# EAGLE schematic TBEAM_V10_Stack (EAGLE 9.6.2)

## Sheet 1 of 2
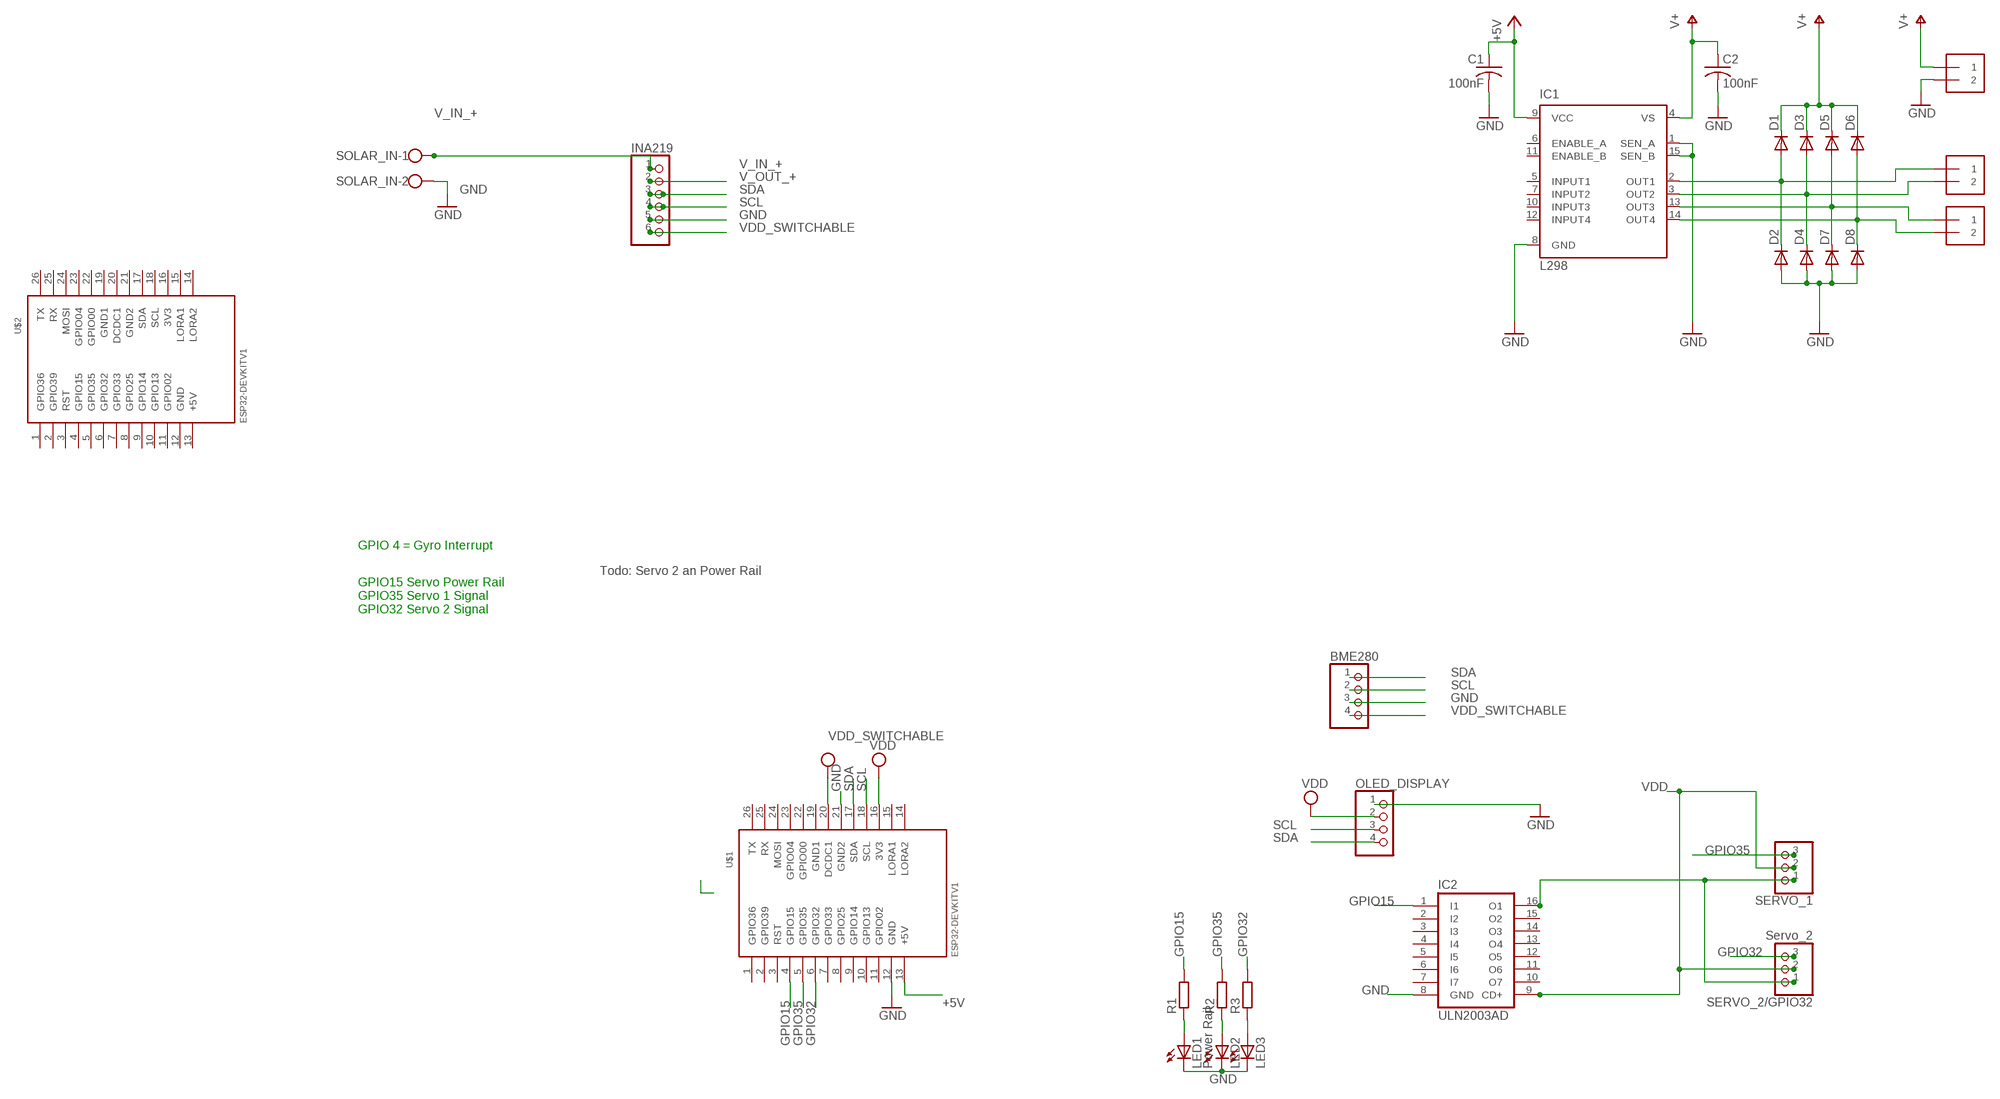
[diagram p0: schematic, sheet 1]

### Parts
BME280  PINHD-1X4  [1X04]
C1  100nF  C-US050-024X044  [C050-024X044]
C2  100nF  C-US050-024X044  [C050-024X044]
D1  DIODE-D-5  [D-5]
D2  DIODE-D-5  [D-5]
D3  DIODE-D-5  [D-5]
D4  DIODE-D-5  [D-5]
D5  DIODE-D-5  [D-5]
D6  DIODE-D-5  [D-5]
D7  DIODE-D-5  [D-5]
D8  DIODE-D-5  [D-5]
IC1  L298  [MULTIWATT-15]
IC2  ULN2003AD  [SO16]
INA219  PINHD-1X6  [1X06]
J1  1X2-3.5MM  [1X2-3.5MM]
J2  1X2-3.5MM  [1X2-3.5MM]
J3  1X2-3.5MM  [1X2-3.5MM]
LED1  Power Rail  LEDSML1206  [SML1206]
LED2  LEDSML1206  [SML1206]
LED3  LEDSML1206  [SML1206]
OLED_DISPLAY  PINHD-1X4  [1X04]
R1  R-EU_R1206  [R1206]
R2  R-EU_R1206  [R1206]
R3  R-EU_R1206  [R1206]
SERVO_1  PINHD-1X3  [1X03]
SERVO_2/GPIO32  Servo_2  PINHD-1X3  [1X03]
SOLAR_IN  W237-102  [W237-102]
U$1  ESP32DEVKITV1  [ESP32-DEVKITV1]
U$2  ESP32DEVKITV1  [ESP32-DEVKITV1]

### Nets
+5V: C1.1 IC1.9(VCC) U$1.13(+5V)
GND: BME280.3 C1.2 C2.2 D2.A D4.A D7.A D8.A IC1.1(SEN_A) IC1.8(GND) IC1.15(SEN_B) IC2.8(GND) INA219.5 J1.2 LED1.C LED2.C LED3.C OLED_DISPLAY.1 SOLAR_IN.2 U$1.12(GND) U$1.21(GND2)
GPIO15: IC2.1(I1) R1.2 U$1.4(GPIO15)
GPIO32: R3.2 SERVO_2/GPIO32.3 U$1.6(GPIO32)
GPIO35: R2.2 SERVO_1.3 U$1.5(GPIO35)
N$2: IC2.16(O1) SERVO_1.1 SERVO_2/GPIO32.1
N$4: LED1.A R1.1
N$5: LED2.A R2.1
N$6: LED3.A R3.1
N$7: D1.A D2.C IC1.2(OUT1) J2.1
N$8: D3.A D4.C IC1.3(OUT2) J2.2
N$9: D6.A D8.C IC1.14(OUT4) J3.2
N$10: D5.A D7.C IC1.13(OUT3) J3.1
SCL: BME280.2 INA219.4 OLED_DISPLAY.3 U$1.18(SCL)
SDA: BME280.1 INA219.3 OLED_DISPLAY.4 U$1.17(SDA)
V+: C2.1 D1.C D3.C D5.C D6.C IC1.4(VS) J1.1
V_IN_+: INA219.1 SOLAR_IN.1
V_OUT_+: INA219.2
VDD: IC2.9(CD+) OLED_DISPLAY.2 SERVO_1.2 SERVO_2/GPIO32.2 U$1.16(3V3)
VDD_SWITCHABLE: BME280.4 INA219.6 U$1.20(DCDC1) ; supply symbol labelled VDD
Unconnected: IC1.5(INPUT1) IC1.6(ENABLE_A) IC1.7(INPUT2) IC1.10(INPUT3) IC1.11(ENABLE_B) IC1.12(INPUT4) IC2.2(I2) IC2.3(I3) IC2.4(I4) IC2.5(I5) IC2.6(I6) IC2.7(I7) IC2.10(O7) IC2.11(O6) IC2.12(O5) IC2.13(O4) IC2.14(O3) IC2.15(O2) U$1.1(GPIO36) U$1.2(GPIO39) U$1.3(RST) U$1.7(GPIO33) U$1.8(GPIO25) U$1.9(GPIO14) U$1.10(GPIO13) U$1.11(GPIO02) U$1.14(LORA2) U$1.15(LORA1) U$1.19(GND1) U$1.22(GPIO00) U$1.23(GPIO04) U$1.24(MOSI) U$1.25(RX) U$1.26(TX) U$2.1(GPIO36) U$2.2(GPIO39) U$2.3(RST) U$2.4(GPIO15) U$2.5(GPIO35) U$2.6(GPIO32) U$2.7(GPIO33) U$2.8(GPIO25) U$2.9(GPIO14) U$2.10(GPIO13) U$2.11(GPIO02) U$2.12(GND) U$2.13(+5V) U$2.14(LORA2) U$2.15(LORA1) U$2.16(3V3) U$2.17(SDA) U$2.18(SCL) U$2.19(GND1) U$2.20(DCDC1) U$2.21(GND2) U$2.22(GPIO00) U$2.23(GPIO04) U$2.24(MOSI) U$2.25(RX) U$2.26(TX)

### Notes on the sheet
- GPIO 4 = Gyro Interrupt
- Todo: Servo 2 an Power Rail
- GPIO15 Servo Power Rail
  GPIO35 Servo 1 Signal
  GPIO32 Servo 2 Signal

## Sheet 2 of 2

## Library data of the parts
BME280 OLED_DISPLAY = pinhead:PINHD-1X4: PIN HEADER
C1 C2 = rcl:C-US: CAPACITOR, American symbol
D1-D8 = diode:DIODE-: DIODE
IC1 = st-microelectronics:L298: DUAL FULL-BRIDGE DRIVER; MPN: L298N; OC_FARNELL: 1589425; OC_NEWARK: 32M1527
IC2 = uln-udn:ULN2003A: DRIVER ARRAY
INA219 = pinhead:PINHD-1X6: PIN HEADER
J1-J3 = adafruit:1X2: 3.5mm Terminal block http://www.ladyada.net/library/pcb/eaglelibrary.html
LED1-LED3 = led:LED: LED OSRAM: - CHIPLED LG R971, LG N971, LY N971, LG Q971, LY Q971, LO R971, LY R971 LH N974, LH R974 LS Q976, LO Q976, LY Q976 LO Q996 - Hyper CHIPLED LW Q18S LB Q993, LB Q99A, LB R99A - SideLED LS A670, LO A670, LY A670, LG A670, LP A670 LB A673, LV A673, LT A673, LW A673 LH A674 LY A675 LS A676, LA A676, LO A676, LY A676, LW A676 LS A679, LY A679, LG A679 - Hyper Micro SIDELED® LS Y876, LA Y876, LO Y876, LY Y876 LT Y87S - SmartLED LW L88C, LW L88S LB L89C, LB L89S, LG L890 LS L89K, LO L89K, LY L89K LS L896, LA L896, LO L896, LY L896 - TOPLED LS T670, LO T670, LY T670, LG T670, LP T670 LSG T670, LSP T670, LSY T670, LOP T670, LYG T670 LG T671, LOG T671, LSG T671 LB T673, LV T673, LT T673, LW T673 LH T674 LS T676, LA T676, LO T676, LY T676, LB T676, LH T676, LSB T676, LW T676 LB T67C, LV T67C, LT T67C, LS T67K, LO T67K, LY T67K, LW E67C LS E67B, LA E67B, LO E67B, LY E67B, LB E67C, LV E67C, LT E67C LW T67C LS T679, LY T679, LG T679 LS T770, LO T770, LY T770, LG T770, LP T770 LB T773, LV T773, LT T773, LW T773 LH T774 LS E675, LA E675, LY E675, LS T675 LS T776, LA T776, LO T776, LY T776, LB T776 LHGB T686 LT T68C, LB T68C - Hyper Mini TOPLED® LB M676 - Mini TOPLED Santana® LG M470 LS M47K, LO M47K, LY M47K Source: http://www.osram.convergy.de LUXEON: - LUMILED® LXK2-PW12-R00, LXK2-PW12-S00, LXK2-PW14-U00, LXK2-PW14-V00 LXK2-PM12-R00, LXK2-PM12-S00, LXK2-PM14-U00 LXK2-PE12-Q00, LXK2-PE12-R00, LXK2-PE12-S00, LXK2-PE14-T00, LXK2-PE14-U00 LXK2-PB12-K00, LXK2-PB12-L00, LXK2-PB12-M00, LXK2-PB14-N00, LXK2-PB14-P00, LXK2-PB14-Q00 LXK2-PR12-L00, LXK2-PR12-M00, LXK2-PR14-Q00, LXK2-PR14-R00 LXK2-PD12-Q00, LXK2-PD12-R00, LXK2-PD12-S00 LXK2-PH12-R00, LXK2-PH12-S00 LXK2-PL12-P00, LXK2-PL12-Q00, LXK2-PL12-R00 Source: www.luxeon.com KINGBRIGHT: KA-3528ASYC Source: www.kingbright.com
R1-R3 = resistor:R-EU_: RESISTOR, European symbol
SERVO_1 SERVO_2/GPIO32 = pinhead:PINHD-1X3: PIN HEADER
SOLAR_IN = con-wago-500:W237-102: WAGO SCREW CLAMP; MPN: 237-102; OC_FARNELL: unknown; OC_NEWARK: 70K9898
U$1 U$2 = TTGO T-Beam V10:ESP32DEVKITV1